# EAGLE design mother (EAGLE 9.6.2)
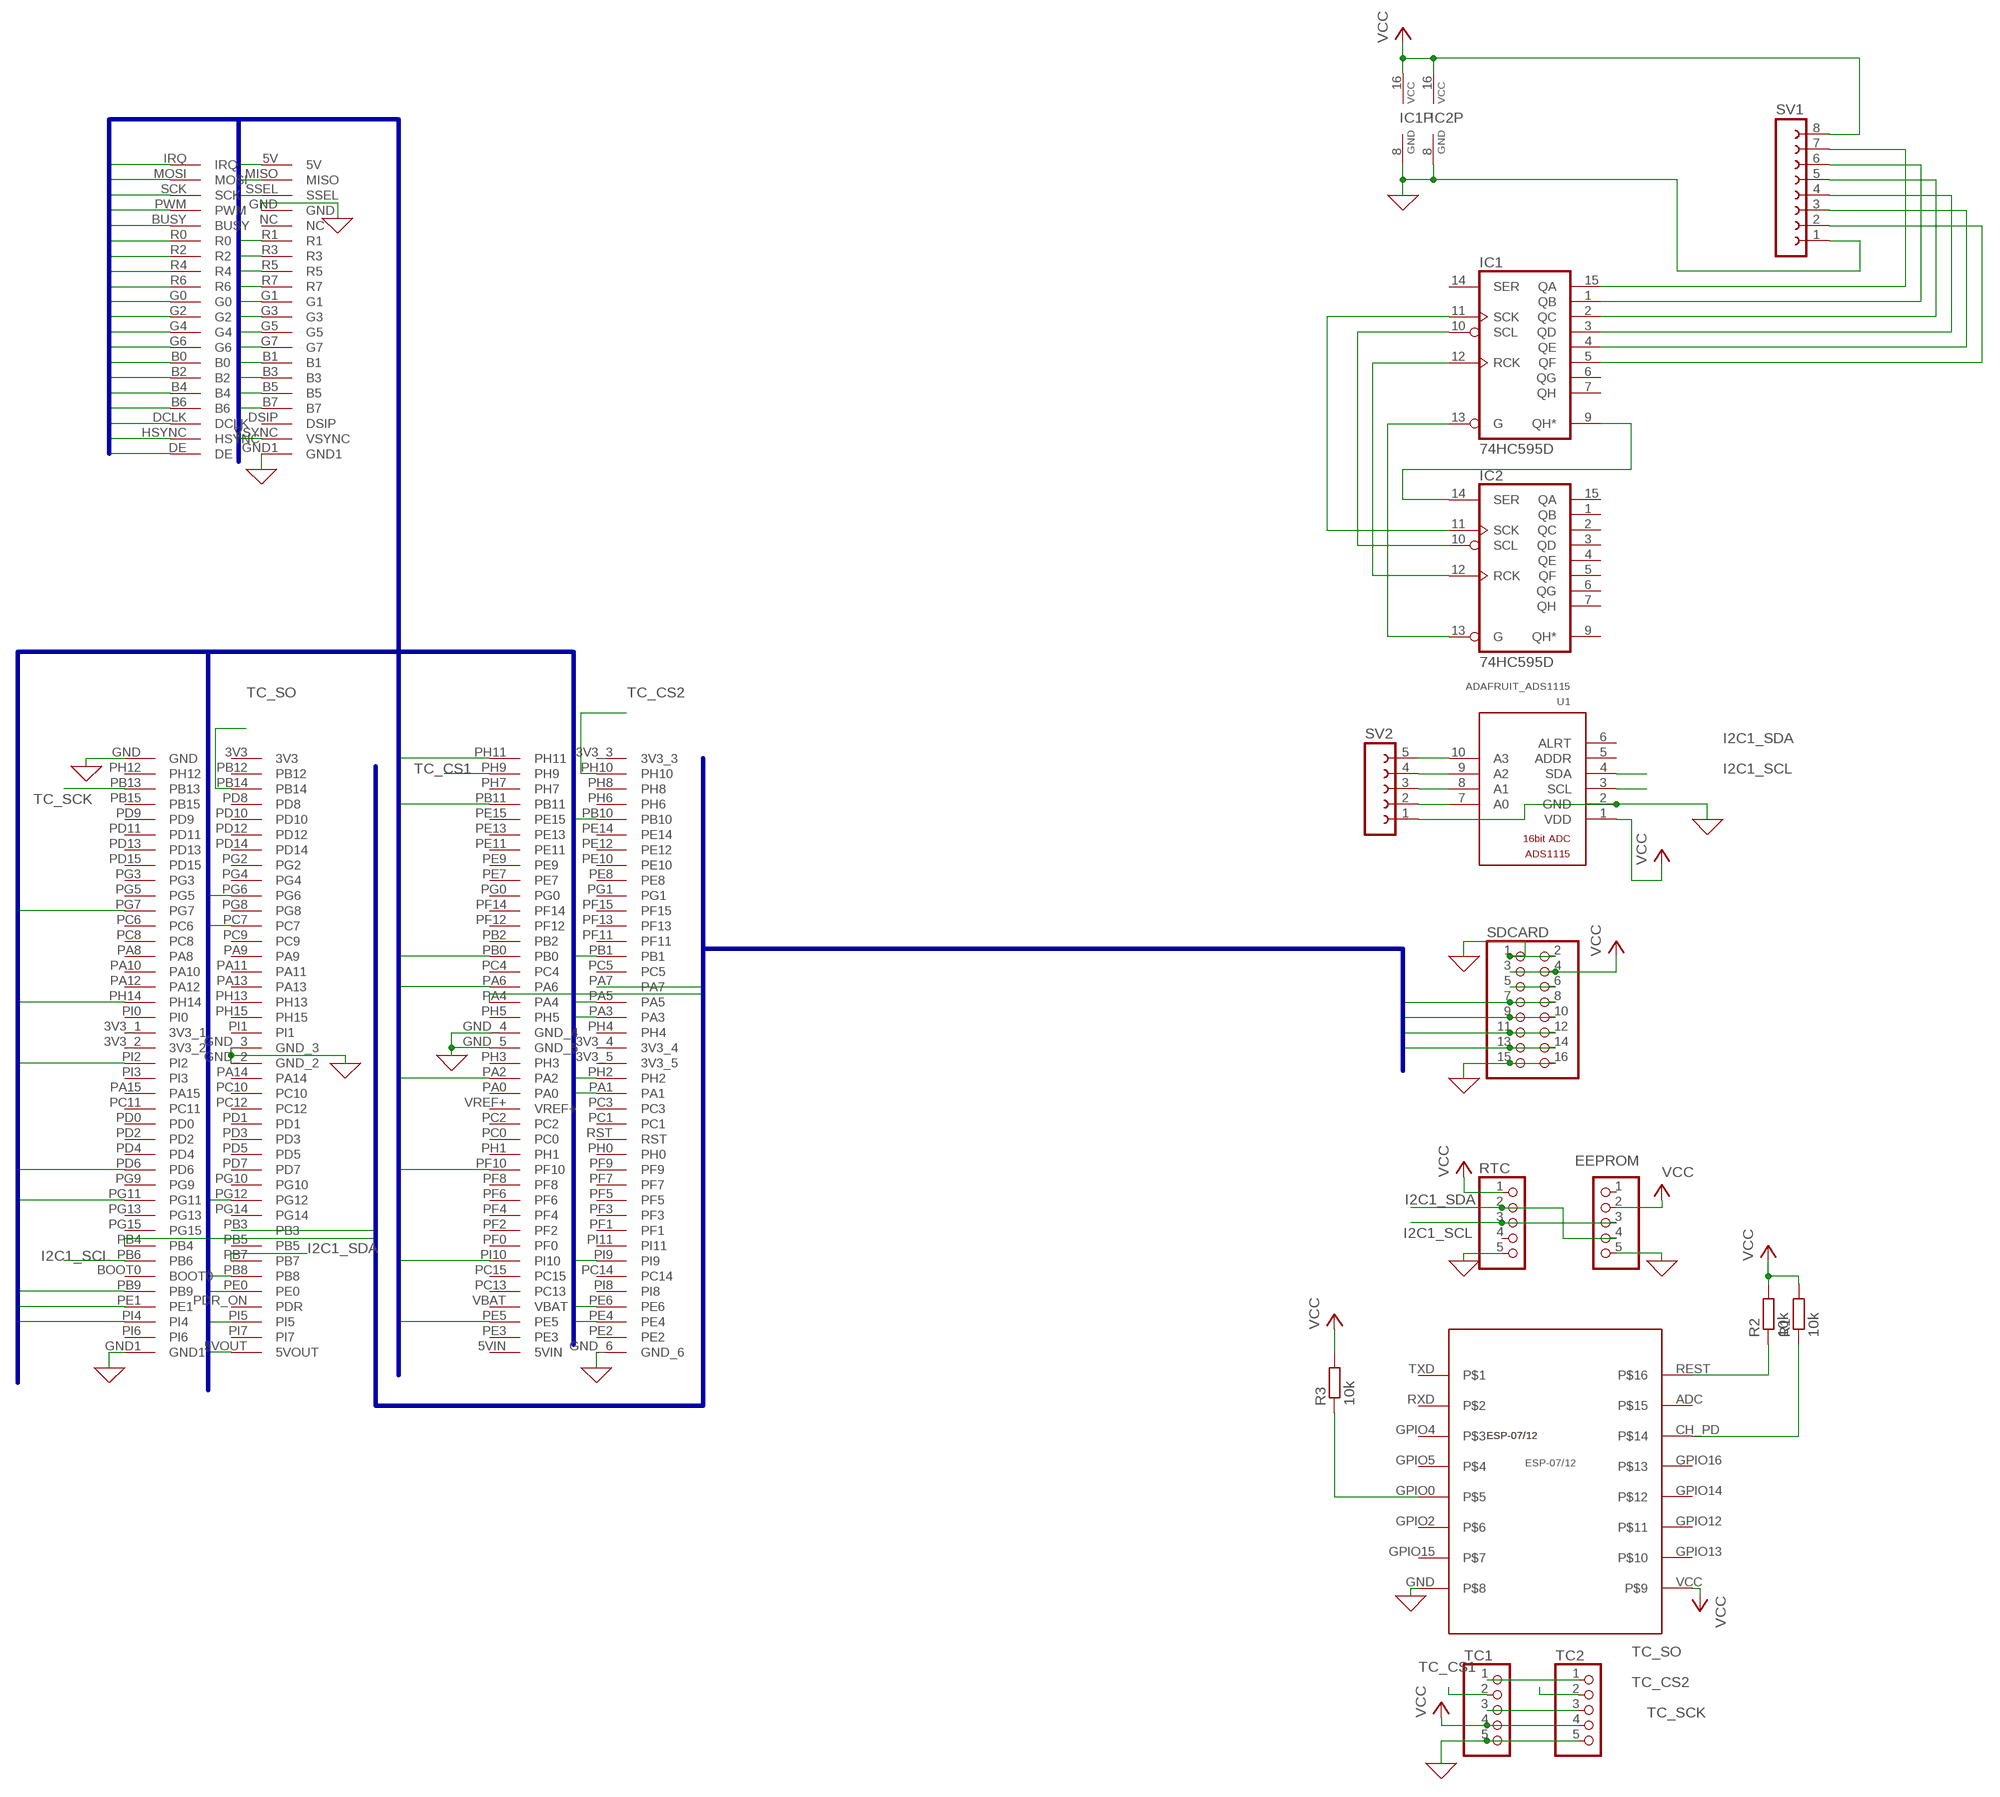
[diagram p0: schematic, sheet 1]

## Parts
EEPROM  PINHD-1X5  [1X05]
IC1  74HC595D  [SO16]
IC2  74HC595D  [SO16]
R1  10k  R-EU_R1206  [R1206]
R2  10k  R-EU_R1206  [R1206]
R3  10k  R-EU_R1206  [R1206]
RTC  PINHD-1X5  [1X05]
SDCARD  PINHD-2X8  [2X08]
SV1  FE08-1  [FE08]
SV2  FE05-1  [FE05-1]
TC1  PINHD-1X5  [1X05]
TC2  PINHD-1X5  [1X05]
U1  ADAFRUIT_ADS1115  [ADAFRUIT_ADS1115_16BIT_I2C_ADC]
U$1  LCDTFT  [4.3LCDTFT]
U$2  HEADER2X40_2MM  [HEADER]
U$3  ESP-07/12  [ESP-07/12]

## Nets
0: EEPROM.5 IC1.8(GND) IC2.8(GND) RTC.5 SDCARD.1 SDCARD.2 SDCARD.15 SDCARD.16 SV1.1 SV2.1 TC1.5 TC2.5 U1.2(GND) U$1.GND U$1.GND1 U$2.GND U$2.GND1 U$2.GND_2 U$2.GND_3 U$2.GND_4 U$2.GND_5 U$2.GND_6 U$3.GND ; supply symbol labelled GND
5V: U$1.5V U$2.5VOUT
B0: U$1.B0 U$2.PE4
B1: U$1.B1 U$2.PG12
B2: U$1.B2 U$2.PD6
B3: U$1.B3 U$2.PG11
B4: U$1.B4 U$2.PI4
B5: U$1.B5 U$2.PA3
B6: U$1.B6 U$2.PB8
B7: U$1.B7 U$2.PB9
BUSY: U$1.BUSY U$2.PE0
CLK: SDCARD.11 SDCARD.12 U$2.PB3
CLK_LTDC: U$1.DCLK U$2.PG7
CS: SDCARD.7 SDCARD.8 U$2.PA4
DE: U$1.DE U$2.PF10
G0: U$1.G0 U$2.PE5
G1: U$1.G1 U$2.PE6
G2: U$1.G2 U$2.PA6
G3: U$1.G3 U$2.PH14
G4: U$1.G4 U$2.PB10
G5: U$1.G5 U$2.PB11
G6: U$1.G6 U$2.PC7
G7: U$1.G7 U$2.PI2
HSYNC: U$1.HSYNC U$2.PI10
I2C1_SCL: EEPROM.3 RTC.3 U1.3(SCL) U$2.PB6
I2C1_SDA: EEPROM.4 RTC.2 U1.4(SDA) U$2.PB7
IRQ: U$1.IRQ U$2.PE1
MISO: SDCARD.13 SDCARD.14 U$2.PB4
MOSI: SDCARD.9 SDCARD.10 U$2.PA7
N$1: IC1.11(SCK) IC2.11(SCK)
N$2: IC1.10(SCL) IC2.10(SCL)
N$3: IC1.12(RCK) IC2.12(RCK)
N$4: IC1.13(G) IC2.13(G)
N$5: R3.1 U$3.GPIO0
N$6: IC1.9(QH*) IC2.14(SER)
N$7: SV2.5 U1.10(A3)
N$8: SV2.4 U1.9(A2)
N$9: IC1.15(QA) SV1.7
N$10: IC1.1(QB) SV1.6
N$11: IC1.2(QC) SV1.5
N$12: IC1.3(QD) SV1.4
N$13: IC1.4(QE) SV1.3
N$14: IC1.5(QF) SV1.2
N$15: SV2.3 U1.8(A1)
N$16: SV2.2 U1.7(A0)
N$17: R2.1 U$3.REST
N$18: SDCARD.5 SDCARD.6
N$19: R1.1 U$3.CH_PD
PWM: U$1.PWM U$2.PI5
R0: U$1.R0 U$2.PH2
R1: U$1.R1 U$2.PA2
R2: U$1.R2 U$2.PA1
R3: U$1.R3 U$2.PB0
R4: U$1.R4 U$2.PA5
R5: U$1.R5 U$2.PH11
R6: U$1.R6 U$2.PB1
R7: U$1.R7 U$2.PG6
TC_CS1: TC1.2 U$2.PH9
TC_CS2: TC2.2 U$2.PH10
TC_SCK: TC1.3 TC2.3 U$2.PB13
TC_SO: TC1.1 TC2.1 U$2.PB14
TOUCH_MISO: U$1.MISO
TOUCH_MOSI: U$1.MOSI
TOUCH_SCK: U$1.SCK
TOUCH_SS: U$1.SSEL
VCC: EEPROM.2 IC1.16(VCC) IC2.16(VCC) R1.2 R2.2 R3.2 RTC.1 SDCARD.3 SDCARD.4 SV1.8 TC1.4 TC2.4 U1.1(VDD) U$3.VCC
VSYNC: U$1.VSYNC U$2.PI9
Unconnected: EEPROM.1 IC1.6(QG) IC1.7(QH) IC1.14(SER) IC2.1(QB) IC2.2(QC) IC2.3(QD) IC2.4(QE) IC2.5(QF) IC2.6(QG) IC2.7(QH) IC2.9(QH*) IC2.15(QA) RTC.4 U1.5(ADDR) U1.6(ALRT) U$1.DSIP U$1.NC U$2.3V3 U$2.3V3_1 U$2.3V3_2 U$2.3V3_3 U$2.3V3_4 U$2.3V3_5 U$2.5VIN U$2.BOOT0 U$2.PA0 U$2.PA8 U$2.PA9 U$2.PA10 U$2.PA11 U$2.PA12 U$2.PA13 U$2.PA14 U$2.PA15 U$2.PB2 U$2.PB5 U$2.PB12 U$2.PB15 U$2.PC0 U$2.PC1 U$2.PC2 U$2.PC3 U$2.PC4 U$2.PC5 U$2.PC6 U$2.PC8 U$2.PC9 U$2.PC10 U$2.PC11 U$2.PC12 U$2.PC13 U$2.PC14 U$2.PC15 U$2.PD0 U$2.PD1 U$2.PD2 U$2.PD3 U$2.PD4 U$2.PD5 U$2.PD7 U$2.PD8 U$2.PD9 U$2.PD10 U$2.PD11 U$2.PD12 U$2.PD13 U$2.PD14 U$2.PD15 U$2.PDR_ON(PDR) U$2.PE2 U$2.PE3 U$2.PE7 U$2.PE8 U$2.PE9 U$2.PE10 U$2.PE11 U$2.PE12 U$2.PE13 U$2.PE14 U$2.PE15 U$2.PF0 U$2.PF1 U$2.PF2 U$2.PF3 U$2.PF4 U$2.PF5 U$2.PF6 U$2.PF7 U$2.PF8 U$2.PF9 U$2.PF11 U$2.PF12 U$2.PF13 U$2.PF14 U$2.PF15 U$2.PG0 U$2.PG1 U$2.PG2 U$2.PG3 U$2.PG4 U$2.PG5 U$2.PG8 U$2.PG9 U$2.PG10 U$2.PG13 U$2.PG14 U$2.PG15 U$2.PH0 U$2.PH1 U$2.PH3 U$2.PH4 U$2.PH5 U$2.PH6 U$2.PH7 U$2.PH8 U$2.PH12 U$2.PH13 U$2.PH15 U$2.PI0 U$2.PI1 U$2.PI3 U$2.PI6 U$2.PI7 U$2.PI8 U$2.PI11 U$2.RST U$2.VBAT U$2.VREF+ U$3.ADC U$3.GPIO2 U$3.GPIO4 U$3.GPIO5 U$3.GPIO12 U$3.GPIO13 U$3.GPIO14 U$3.GPIO15 U$3.GPIO16 U$3.RXD U$3.TXD

## Buses
LCD:5V,B[0..7],BUSY,CLK_LTDC,DE,G[0..7],HSYNC,IRQ,PWM,R[0..7],TOUCH_MISO,TOUCH_MOSI,TOUCH_SCK,TOUCH_SS,VSYNC
SPI:CLK,CS,MISO,MOSI

## Library data of the parts
EEPROM RTC TC1 TC2 = pinhead:PINHD-1X5: PIN HEADER
IC1 IC2 = 74xx-eu:74*595: 8-bit SHIFT REGISTER, output latch
R1-R3 = rcl:R-EU_: RESISTOR, European symbol; SPICEPREFIX: R
SDCARD = pinhead:PINHD-2X8: PIN HEADER
SV1 = con-lsta:FE08-1: FEMALE HEADER; OC_FARNELL: unknown; OC_NEWARK: unknown
SV2 = con-lsta:FE05-1: FEMALE HEADER; OC_FARNELL: unknown; OC_NEWARK: unknown
U1 = AD convertor:ADAFRUIT_ADS1115
U$1 = lcd4.3tft:LCDTFT
U$2 = CORE746I:HEADER2X40_2MM
U$3 = ESP-07_12:ESP-07/12: Version 1.0 of the library for the ESP-07/12 full GPIO dev board module byME Jon jonnyradu@gmail.com

## Board
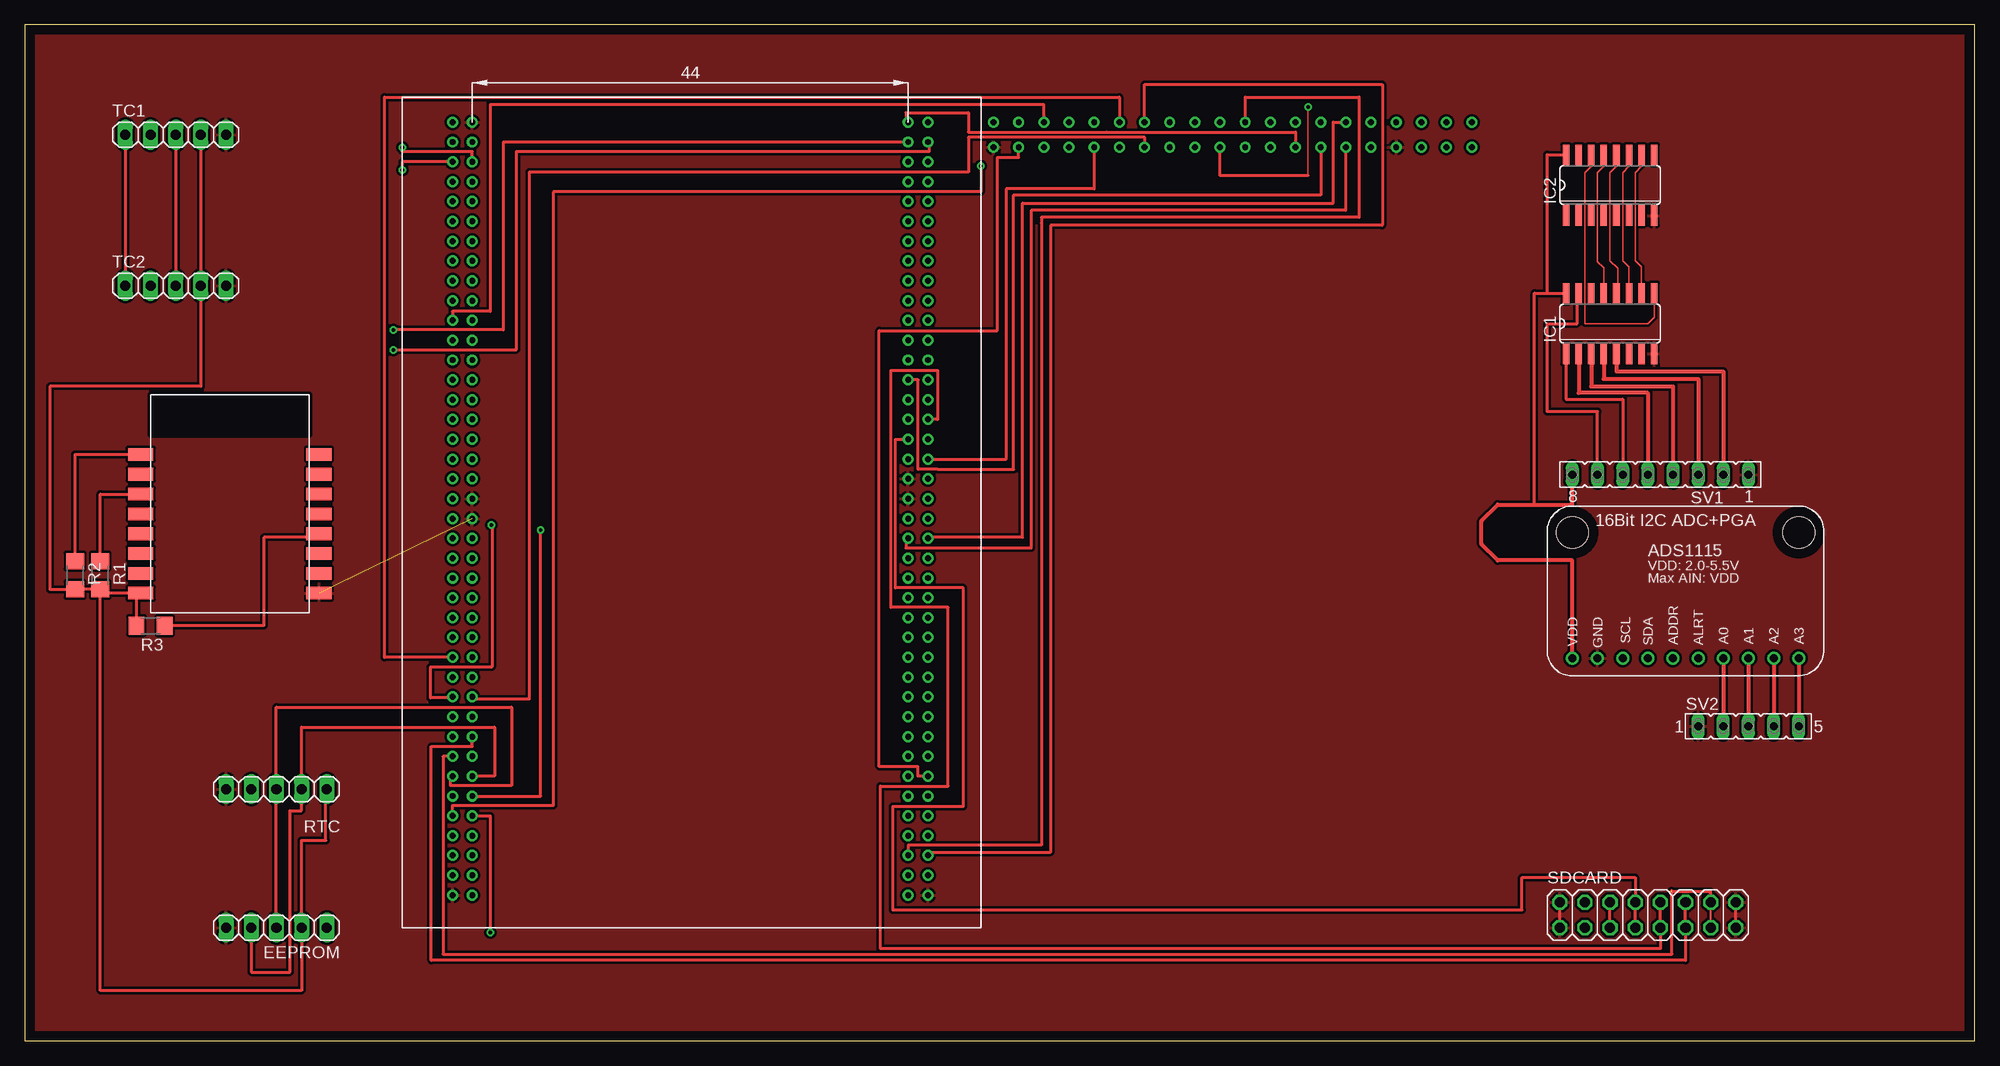
[diagram p1: board, top side]
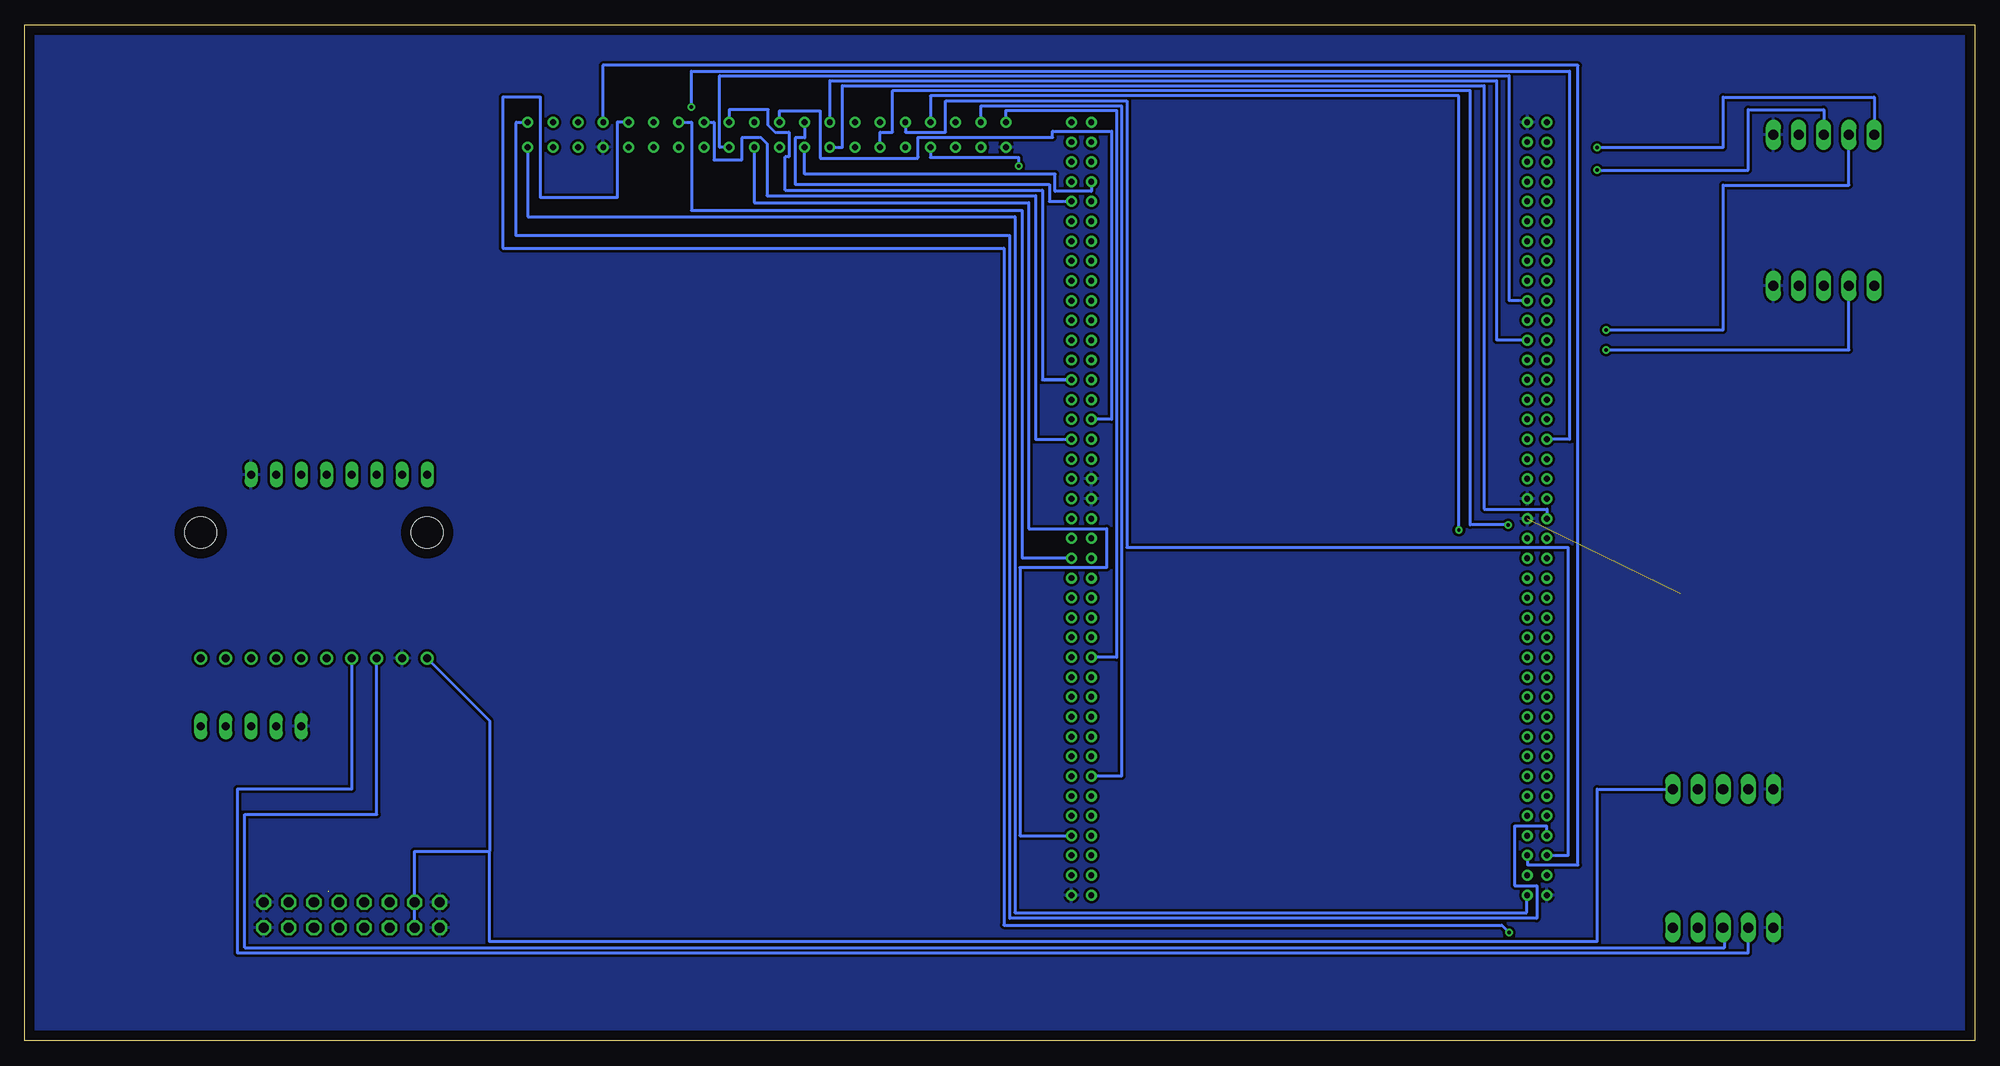
[diagram p2: board, bottom side, seen from below]

Size 196.83 x 102.54 mm. Coordinates in mm from the lower left corner, seen from the top.
Outline: 0,0 196.83,0 196.83,102.54 0,102.54 0,0
Copper layers (1*16): Top 0.035mm / dielectric 1.5mm / Bottom 0.035mm
Design rules "default": minimum track width 6mil, minimum drill 0.35mm, track to track 6mil, track to pad 6mil, pad to pad 6mil, via to via 6mil, smd to smd 6mil, copper to edge 40mil, drill to drill 6mil, minimum pad ring 10mil, minimum via ring 8mil, stop-mask expansion 4mil, vias tented up to drill 0mil, thermal gap 10mil

### Footprints (pad centres in the part's own frame; a part is rotated, then mirrored left to right if it is on the bottom)
1X05 = drill 1.016 long: 1 -5.08,0; 2 -2.54,0; 3 0,0; 4 2.54,0; 5 5.08,0
SO16 = smd 0.66 x 2.032: 1 -4.445,-3.073; 2 -3.175,-3.073; 3 -1.905,-3.073; 4 -0.635,-3.073; 5 0.635,-3.073; 6 1.905,-3.073; 7 3.175,-3.073; 8 4.445,-3.073; 9 4.445,3.073; 10 3.175,3.073; 11 1.905,3.073; 12 0.635,3.073; 13 -0.635,3.073; 14 -1.905,3.073; 15 -3.175,3.073; 16 -4.445,3.073
R1206 = smd 1.6 x 1.803: 1 -1.422,0; 2 1.422,0
2X08 = drill 1.016 octagon: 1 -8.89,-1.27; 2 -8.89,1.27; 3 -6.35,-1.27; 4 -6.35,1.27; 5 -3.81,-1.27; 6 -3.81,1.27; 7 -1.27,-1.27; 8 -1.27,1.27; 9 1.27,-1.27; 10 1.27,1.27; 11 3.81,-1.27; 12 3.81,1.27; 13 6.35,-1.27; 14 6.35,1.27; 15 8.89,-1.27; 16 8.89,1.27
FE08 = drill 0.813 long: 1 -8.89,0; 2 -6.35,0; 3 -3.81,0; 4 -1.27,0; 5 1.27,0; 6 3.81,0; 7 6.35,0; 8 8.89,0
FE05-1 = drill 0.813 long: 1 -5.08,0; 2 -2.54,0; 3 0,0; 4 2.54,0; 5 5.08,0
ADAFRUIT_ADS1115_16BIT_I2C_ADC = drill 0.8: 1 2.54,1.778; 2 5.08,1.778; 3 7.62,1.778; 4 10.16,1.778; 5 12.7,1.778; 6 15.24,1.778; 7 17.78,1.778; 8 20.32,1.778; 9 22.86,1.778; 10 25.4,1.778 | hole 3.2: 2.54,14.478; 25.4,14.478
4.3LCDTFT = drill 0.6: 5V 2.54,0; B0 0,-33.02; B1 2.54,-33.02; B2 0,-35.56; B3 2.54,-35.56; B4 0,-38.1; B5 2.54,-38.1; B6 0,-40.64; B7 2.54,-40.64; BUSY 0,-10.16; DCLK 0,-43.18; DE 0,-48.26; DSIP 2.54,-43.18; G0 0,-22.86; G1 2.54,-22.86; G2 0,-25.4; G3 2.54,-25.4; G4 0,-27.94; G5 2.54,-27.94; G6 0,-30.48; G7 2.54,-30.48; GND 2.54,-7.62; GND1 2.54,-48.26; HSYNC 0,-45.72; IRQ 0,0; MISO 2.54,-2.54; MOSI 0,-2.54; NC 2.54,-10.16; PWM 0,-7.62; R0 0,-12.7; R1 2.54,-12.7; R2 0,-15.24; R3 2.54,-15.24; R4 0,-17.78; R5 2.54,-17.78; R6 0,-20.32; R7 2.54,-20.32; SCK 0,-5.08; SSEL 2.54,-5.08; VSYNC 2.54,-45.72
HEADER = drill 0.6: 3V3 0,0; 3V3_1 0,-36; 3V3_2 0,-38; 3V3_3 48,0; 3V3_4 48,-38; 3V3_5 48,-40; 5VIN 46,-78; 5VOUT 2,-78; BOOT0 0,-68; GND 2,0; GND1 0,-78; GND_2 2,-40; GND_3 2,-38; GND_4 46,-36; GND_5 46,-38; GND_6 48,-78; PA0 46,-44; PA1 48,-44; PA2 46,-42; PA3 48,-34; PA4 46,-32; PA5 48,-32; PA6 46,-30; PA7 48,-30; PA8 0,-26; PA9 2,-26; PA10 0,-28; PA11 2,-28; PA12 0,-30; PA13 2,-30; PA14 2,-42; PA15 0,-44; PB0 46,-26; PB1 48,-26; PB2 46,-24; PB3 2,-62; PB4 0,-64; PB5 2,-64; PB6 0,-66; PB7 2,-66; PB8 2,-68; PB9 0,-70; PB10 48,-8; PB11 46,-6; PB12 2,-2; PB13 0,-4; PB14 2,-4; PB15 0,-6; PC0 46,-50; PC1 48,-48; PC2 46,-48; PC3 48,-46; PC4 46,-28; PC5 48,-28; PC6 0,-22; PC7 2,-22; PC8 0,-24; PC9 2,-24; PC10 2,-44; PC11 0,-46; PC12 2,-46; PC13 46,-70; PC14 48,-68; PC15 46,-68; PD0 0,-48; PD1 2,-48; PD2 0,-50; PD3 2,-50; PD4 0,-52; PD5 2,-52; PD6 0,-54; PD7 2,-54; PD8 2,-6; PD9 0,-8; PD10 2,-8; PD11 0,-10; PD12 2,-10; PD13 0,-12; PD14 2,-12; PD15 0,-14; PDR_ON 2,-72; PE0 2,-70; PE1 0,-72; PE2 48,-76; PE3 46,-76; PE4 48,-74; PE5 46,-74; PE6 48,-72; PE7 46,-16; PE8 48,-16; PE9 46,-14; PE10 48,-14; PE11 46,-12; PE12 48,-12; PE13 46,-10; PE14 48,-10; PE15 46,-8; PF0 46,-64; PF1 48,-62; PF2 46,-62; PF3 48,-60; PF4 46,-60; PF5 48,-58; PF6 46,-58; PF7 48,-56; PF8 46,-56; PF9 48,-54; PF10 46,-54; PF11 48,-24; PF12 46,-22; PF13 48,-22; PF14 46,-20; PF15 48,-20; PG0 46,-18; PG1 48,-18; PG2 2,-14; PG3 0,-16; PG4 2,-16; PG5 0,-18; PG6 2,-18; PG7 0,-20; PG8 2,-20; PG9 0,-56; PG10 2,-56; PG11 0,-58; PG12 2,-58; PG13 0,-60; PG14 2,-60; PG15 0,-62; PH0 48,-52; PH1 46,-52; PH2 48,-42; PH3 46,-40; PH4 48,-36; PH5 46,-34; PH6 48,-6; PH7 46,-4; PH8 48,-4; PH9 46,-2; PH10 48,-2; PH11 46,0; PH12 0,-2; PH13 2,-32; PH14 0,-32; PH15 2,-34; PI0 0,-34; PI1 2,-36; PI2 0,-40; PI3 0,-42; PI4 0,-74; PI5 2,-74; PI6 0,-76; PI7 2,-76; PI8 48,-70; PI9 48,-66; PI10 46,-66; PI11 48,-64; RST 48,-50; VBAT 46,-72; VREF+ 46,-46
ESP-07/12 = smd 2.54 x 1.27: ADC -1,14; CH_PD -1,12; GND 17,2; GPIO0 17,8; GPIO2 17,6; GPIO4 17,12; GPIO5 17,10; GPIO12 -1,6; GPIO13 -1,4; GPIO14 -1,8; GPIO15 17,4; GPIO16 -1,10; REST -1,16; RXD 17,14; TXD 17,16; VCC -1,2

### Placement (x,y rotation side)
EEPROM  25.4,11.43 180 top
IC1  160.02,72.39 0 top
IC2  160.02,86.36 0 top
R1  7.62,46.99 270 top
R2  5.08,46.99 270 top
R3  12.7,41.91 180 top
RTC  25.4,25.4 180 top
SDCARD  163.83,12.7 0 top
SV1  165.1,57.15 180 top
SV2  173.99,31.75 0 top
TC1  15.24,91.44 0 top
TC2  15.24,76.2 0 top
U1  153.67,36.83 0 top
U$1  146.05,92.71 270 top
U$2  43.18,92.71 0 top
U$3  12.7,43.18 0 top

### Tracks (layer width: path | path; a pad name or v marks a point on that pad's centre or on a via)
0  (1 unrouted)
  Top 0.152: 164.59,69.34 IC1.8 164.59,69.09 | 164.59,83.06 IC2.8 164.59,83.31
  Top 0.305: SDCARD.1 SDCARD.2 | SDCARD.15 SDCARD.16
  pour Bottom (isolate 0.254): 0,0 196.85,0 196.85,102.87 0,102.87
  pour Top (isolate 0.254): 0,0 0,102.87 196.85,102.87 196.85,0
5V
  Bottom 0.152: 45.21,14.73 U$2.5VOUT
  Bottom 0.305: U$1.5V 146.05,83.19 96.9,83.19 96.9,12.95 45.21,12.95 45.21,14.73
B0
  Top 0.305: U$1.B0 113.03,96.52 137.03,96.52 137.03,82.3 103.56,82.3 103.56,19.05 91.18,19.05 U$2.PE4
B1
  Top 0.305: U$2.PG12 45.41,34.48 50.93,34.48 50.93,87.67 95.25,87.67 95.25,91.19 113.03,91.19 U$1.B1
B2
  Top 0.305: U$2.PD6 36.32,38.71 36.32,95.25 110.49,95.25 U$1.B2
B3  (via drill 0.35)
  Top 0.305: U$2.PG11 43.08,34.61 40.95,34.61 40.95,37.75 47.16,37.75 47.16,52.03 v47.12,52.07
  Bottom 0.305: U$1.B3 110.49,91.69 109.22,91.69 109.22,95.89 50.93,95.89 50.93,52.07 v47.12,52.07
B4
  Bottom 0.305: U$2.PI4 41.02,18.71 41.02,49.78 85.6,49.78 85.6,94.87 103.89,94.87 103.89,91.69 107.95,91.69 U$1.B4
B5
  Top 0.305: U$2.PA3 99.06,58.71 99.06,85.98 107.95,85.98 U$1.B5
B6  (via drill 0.35)
  Top 0.305: U$2.PB8 52.07,24.71 v52.07,51.56
  Bottom 0.305: v52.07,51.56 52.07,95.38 105.41,95.38 U$1.B6
B7  (via drill 0.35)
  Top 0.305: U$2.PB9 43.18,23.75 53.34,23.75 53.34,85.69 96.52,85.69 v96.52,88.27 96.52,88.27
  Bottom 0.305: U$1.B7 105.41,89.15 96.52,89.15 v96.52,88.27
BUSY  (via drill 0.35)
  Top 0.305: U$2.PE0 46.99,22.71 v46.99,10.92
  Bottom 0.305: U$1.BUSY 137.03,92.71 137.03,85.09 144.78,85.09 144.78,95.25 148.59,95.25 148.59,80.01 97.99,80.01 97.99,11.68 47.75,11.68 v46.99,10.92
CLK
  Top 0.305: 167.59,13.97 SDCARD.12 SDCARD.11 167.64,8.13 41.03,8.13 41.03,29.72 45.18,29.72 U$2.PB3
CLK_LTDC
  Top 0.305: U$2.PG7 43.18,73.62 46.99,73.62 46.99,94.49 102.87,94.49 U$1.DCLK
CS
  Top 0.152: 88.9,60.71 U$2.PA4
  Top 0.305: SDCARD.7 SDCARD.8 162.56,16.51 151.13,16.51 151.13,13.21 87.63,13.21 87.63,23.67 94.74,23.67 94.74,45.72 87.88,45.72 87.88,60.71 88.9,60.71
DE
  Bottom 0.152: 86.61,93.98 86.61,93.9 86.61,38.71 | 97.28,93.85 86.61,93.85
  Bottom 0.305: U$1.DE 97.79,93.9 86.61,93.9 | 86.61,93.85 86.61,38.71 U$2.PF10
G0
  Top 0.152: 89.18,19.75 89.18,19.81 | 134.62,95.25 134.62,83.06 102.62,83.06 102.62,82.55
  Top 0.305: U$1.G0 123.19,95.25 134.62,95.25 134.69,95.25 134.69,83.11 102.62,83.11 102.62,82.55 102.62,19.75 89.18,19.75 U$2.PE5
G1
  Bottom 0.152: U$2.PE6 92.71,20.71
  Bottom 0.305: U$1.G1 123.19,84.58 95.5,84.58 95.5,51.69 87.63,51.69 87.63,47.75 92.14,47.75 96.39,47.75 96.39,20.71 U$2.PE6
G2
  Bottom 0.305: U$1.G2 120.65,93.85 116.53,93.85 116.53,89.08 106.68,89.08 106.68,89.15 106.68,89.21 106.68,91.19 93.08,91.19 93.08,91.8 87.12,91.8 87.12,62.71 U$2.PA6
G3  (via drill 0.35)
  Top 0.152: v129.54,94.23 129.54,87.31
  Top 0.305: U$1.G3 120.65,87.31 129.54,87.31
  Bottom 0.305: v129.54,94.23 129.54,97.87 40.89,97.87 40.89,60.71 U$2.PH14
G4
  Bottom 0.305: U$1.G4 118.11,91.13 119.07,91.13 119.07,86.44 93.4,86.44 93.4,84.71 U$2.PB10
G5
  Bottom 0.305: U$2.PB11 89.18,85.73 92.84,85.73 92.84,87.48 118.11,87.48 U$1.G5
G6
  Bottom 0.305: U$1.G6 115.57,96.9 48.26,96.9 48.26,71.12 48.26,70.71 U$2.PC7
G7
  Bottom 0.305: U$1.G7 114.3,90.17 114.3,96.39 49.53,96.39 49.53,53.67 43.18,53.67 U$2.PI2
HSYNC
  Bottom 0.152: 88.9,26.71 U$2.PI10
  Bottom 0.305: U$1.HSYNC 100.33,94.36 86.11,94.36 86.11,26.71 88.9,26.71
I2C1_SCL
  Top 0.305: EEPROM.3 RTC.3 25.4,33.67 49.14,33.67 49.14,25.75 42.95,25.75 42.95,26.48 U$2.PB6
  Bottom 0.305: EEPROM.3 25.27,11.3 25.27,9.4 174.62,9.4 174.62,22.86 161.29,22.86 U1.3
I2C1_SDA
  Top 0.152: 45.72,26.71 U$2.PB7
  Top 0.305: EEPROM.4 22.86,6.93 26.77,6.93 26.77,23.24 27.94,23.24 RTC.2 27.94,31.67 47.41,31.67 47.41,26.71 45.72,26.71
  Bottom 0.305: U1.4 163.83,25.4 175.39,25.4 175.39,8.89 22.86,8.89 EEPROM.4
IRQ
  Bottom 0.305: U$2.PE1 43.2,20.71 43.2,21.67 46.45,21.67 46.45,15.67 44.22,15.67 44.22,12.37 97.41,12.37 97.41,81.28 147.26,81.28 147.26,92.64 147.19,92.71 U$1.IRQ
MISO  (1 unrouted)
  Top 0.152: SDCARD.14 SDCARD.13 170.13,11.43 170.13,15.06 166.19,15.06
  Top 0.305: SDCARD.14 170.18,15.06 170.13,15.06 166.27,15.06 | U$2.PB4 42.22,28.71 42.22,8.76 166.27,8.76 166.27,15.14 166.19,15.14
MOSI
  Top 0.152: SDCARD.10 165.18,13.89 | 91.44,67.59 92.06,67.59 92.06,62.71
  Top 0.305: SDCARD.10 SDCARD.9 165.1,9.32 86.36,9.32 86.36,25.7 93.21,25.7 93.21,43.75 87.43,43.75 87.43,67.67 92.14,67.67 92.14,62.71 92.06,62.71 U$2.PA7
N$1
  Top 0.152: 162.05,74.93 162.05,75.44 IC1.11 161.93,78.11 161.29,78.74 161.29,87.63 161.93,88.27 IC2.11
N$2
  Top 0.152: IC2.10 163.19,88.27 162.56,87.63 162.56,78.74 163.19,78.11 IC1.10
N$3
  Top 0.152: IC1.12 160.78,75.69 160.78,77.98 160.02,78.74 160.02,87.63 160.66,88.27 IC2.12
N$4
  Top 0.152: 159.51,75.69 IC1.13 | IC1.13 159.38,74.93 | 159.44,89.38 IC2.13 159.38,88.27 158.75,87.63 158.75,78.64 159.38,78 IC1.13
N$5
  Top 0.305: U$3.GPIO0 29.7,50.8 24.13,50.8 24.13,41.91 R3.1
N$6
  Top 0.152: 164.34,74.42 164.34,75.44 IC1.9 164.47,73.03 163.83,72.39 157.48,72.39 157.48,87.63 158.12,88.27 IC2.14
N$7
  Top 0.406: U1.10 SV2.5
N$8
  Top 0.406: U1.9 SV2.4
N$9
  Top 0.152: IC1.15 156.72,75.44 156.72,74.93
  Top 0.305: SV1.7 158.75,63.5 153.67,63.5 153.67,72.39 156.72,72.39 156.72,74.93
N$10
  Top 0.305: IC1.1 155.57,64.77 161.29,64.77 SV1.6
N$11
  Top 0.406: IC1.2 156.84,65.41 163.83,65.41 SV1.5
N$12
  Top 0.406: IC1.3 158.12,66.04 166.37,66.04 SV1.4
N$13
  Top 0.406: IC1.4 159.38,66.8 168.91,66.8 SV1.3
N$14
  Top 0.406: IC1.5 160.66,67.56 171.45,67.56 SV1.2
N$15
  Top 0.406: U1.8 SV2.3
N$16
  Top 0.406: U1.7 SV2.2
N$17
  Top 0.305: R2.1 5.08,59.18 U$3.REST
N$18
  Top 0.305: SDCARD.5 SDCARD.6
N$19
  Top 0.2: 11.43,55.18 U$3.CH_PD
  Top 0.305: R1.1 7.62,55.18 11.43,55.18
PWM
  Bottom 0.305: U$1.PWM 138.5,92.78 138.5,98.45 40.06,98.45 40.06,17.75 45.16,17.75 45.16,18.71 U$2.PI5
R0
  Top 0.152: 91.19,50.8 U$2.PH2
  Top 0.305: 91.19,50.8 100.71,50.8 100.71,84.53 132.08,84.53 132.08,92.71 U$1.R0
R1
  Top 0.305: U$2.PA2 88.95,50.48 88.95,49.75 101.6,49.75 101.6,83.82 133.35,83.82 U$1.R1
R2
  Bottom 0.305: U$1.R2 129.54,92.71 129.54,83.82 96.14,83.82 96.14,48.71 U$2.PA1
R3
  Top 0.305: U$2.PB0 90.17,66.71 90.17,57.67 92.14,57.67 92.14,57.66 99.82,57.66 99.82,85.34 130.81,85.34 U$1.R3
R4
  Bottom 0.305: U$1.R4 127.25,92.71 127.25,88.9 124.46,88.9 124.46,91.13 122.5,91.13 121.92,90.55 121.92,85.29 94.79,85.29 94.79,60.71 U$2.PA5
R5
  Top 0.305: U$2.PH11 88.95,92.94 88.95,93.67 95.25,93.67 95.25,91.69 109.22,91.69 128.27,91.69 U$1.R5
R6
  Bottom 0.152: 93.98,66.8 91.19,66.8 U$2.PB1
  Bottom 0.305: U$1.R6 125.73,93.98 121.79,93.98 121.79,92.38 121.1,91.69 119.69,91.69 119.69,89.21 120.08,89.21 120.08,85.86 94.11,85.86 94.11,66.71 U$2.PB1 93.98,66.71
R7
  Bottom 0.305: U$1.R7 126.69,90.17 126.69,97.41 46.99,97.41 46.99,74.71 U$2.PG6
TC_CS1  (via drill 0.35)
  Top 0.305: U$2.PH9 48.3,90.71 48.3,71.75 v37.21,71.75 v37.21,71.76
  Bottom 0.305: v37.21,71.76 25.4,71.76 25.4,86.36 12.7,86.36 TC1.2
TC_CS2  (via drill 0.35)
  Top 0.305: U$2.PH10 91.28,90.61 91.28,89.75 49.65,89.75 49.65,69.75 37.21,69.75 v37.21,69.72
  Bottom 0.305: v37.21,69.72 12.7,69.72 TC2.2
TC_SCK  (via drill 0.35)
  Top 0.305: U$2.PB13 38.1,88.71 v38.1,87.88 | TC1.3 TC2.3
  Bottom 0.305: v38.1,87.88 22.86,87.88 22.86,93.98 15.24,93.98 TC1.3
TC_SO  (via drill 0.35)
  Top 0.305: U$2.PB14 45.18,89.75 38.1,89.75 v38.1,90.17 | TC1.1 TC2.1
  Bottom 0.305: v38.1,90.17 25.4,90.17 25.4,95.25 10.16,95.25 TC1.1
VCC
  Top 0.152: 155.7,75.69 IC1.16 | 155.7,89.41 IC2.16 | 11.43,45.18 U$3.VCC
  Top 0.305: R3.2 11.28,45.18 11.43,45.18 | U$3.VCC 7.62,45.18 R1.2 | R1.2 R2.2 2.54,45.57 2.54,66.04 17.78,66.04 TC2.4 TC1.4 | RTC.1 30.38,25.4 30.38,20.24 27.94,20.24 EEPROM.2 27.94,5.08 7.62,5.08 R1.2 | 153.67,75.46 IC1.16 | 153.67,75.46 153.67,89.43 IC2.16 | 152.4,54.13 152.4,75.46 153.67,75.46
  Top 0.406: U1.1 156.21,48.49 148.69,48.49 147.04,50.14 147.04,52.48 148.69,54.13 152.4,54.13 156.21,54.13 SV1.8
  Bottom 0.305: 149.92,19.11 157.48,19.11 SDCARD.4 SDCARD.3 | U1.1 149.92,32.32 149.92,19.11 | 149.92,19.11 149.92,10.03 38.1,10.03 38.1,25.4 RTC.1
VSYNC
  Top 0.152: 91.19,26.67 U$2.PI9
  Top 0.305: U$2.PI9 90.14,26.71 90.14,27.67 86.23,27.67 86.23,71.67 98.17,71.67 98.17,89.15 100.33,89.15 U$1.VSYNC